# EAGLE design pump (EAGLE 9.4.2)
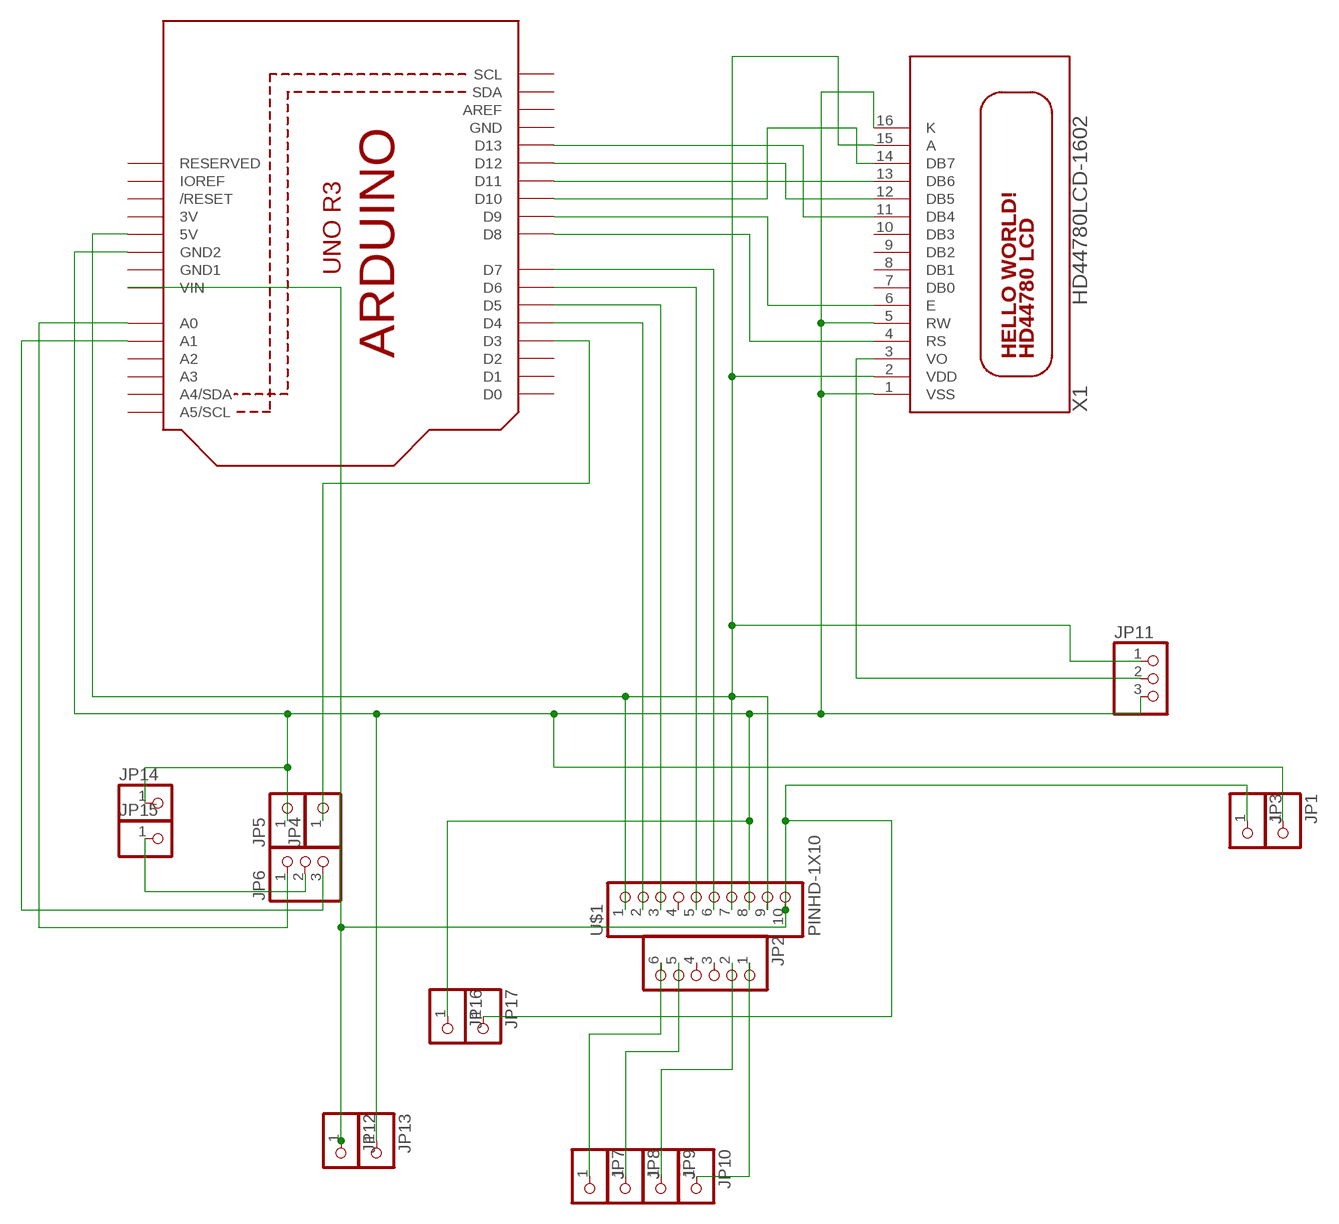
[diagram p0: schematic, sheet 1]

## Parts
JP1  PINHD-1X1CB  [1X01-CLEANBIG]
JP2  PINHD-1X6CB  [1X06-CLEANBIG]
JP3  PINHD-1X1CB  [1X01-CLEANBIG]
JP4  PINHD-1X1CB  [1X01-CLEANBIG]
JP5  PINHD-1X1CB  [1X01-CLEANBIG]
JP6  PINHD-1X3  [1X03]
JP7  PINHD-1X1  [1X01]
JP8  PINHD-1X1  [1X01]
JP9  PINHD-1X1  [1X01]
JP10  PINHD-1X1  [1X01]
JP11  PINHD-1X3  [1X03]
JP12  PINHD-1X1  [1X01]
JP13  PINHD-1X1  [1X01]
JP14  PINHD-1X1  [1X01]
JP15  PINHD-1X1  [1X01]
JP16  PINHD-1X1  [1X01]
JP17  PINHD-1X1  [1X01]
U1  ARDUINOR3-BPLACE  [ARDUINOR3-BPLACE]
U$1  PINHD-1X10  [1X10-BIG]
X1  HD44780LCD-1602  [LCD1602]

## Nets
N$1: JP6.2 JP15.1
N$3: JP6.1 U1.A0
N$4: JP6.3 U1.A1
N$5: JP3.1 JP12.1 JP17.1 U1.VIN U$1.10
N$6: JP4.1 U1.D3
N$8: JP11.2 X1.3(VO)
N$12: U1.D13 X1.11(DB4)
N$13: U1.D12 X1.12(DB5)
N$14: U1.D11 X1.13(DB6)
N$15: U1.D10 X1.14(DB7)
N$16: U1.D9 X1.6(E)
N$17: U1.D8 X1.4(RS)
N$18: U1.D7 U$1.6
N$19: U1.D6 U$1.5
N$20: U1.D5 U$1.3
N$21: U1.D4 U$1.2
N$22: JP2.6 JP7.1
N$23: JP2.5 JP8.1
N$24: JP2.2 JP9.1
N$25: JP2.1 JP10.1
VDD: JP11.1 U1.5V U$1.1 U$1.7 U$1.9 X1.2(VDD) X1.15(A)
VSS: JP1.1 JP5.1 JP11.3 JP13.1 JP14.1 JP16.1 U1.GND2 U$1.8 X1.1(VSS) X1.5(RW) X1.16(K)
Unconnected: JP2.3 JP2.4 U1.A2 U1.A3 U1.A4(A4/SDA) U1.A5(A5/SCL) U1.AREF U1.D0 U1.D1 U1.D2 U1.IOREF U1.RESERVED U1.RESET(/RESET) U1.SCL U1.SDA U$1.4 X1.7(DB0) X1.8(DB1) X1.9(DB2) X1.10(DB3)

## Power pins joined to a net without a drawn wire
3V: U1.3V
GND: U1.GND
GND1: U1.GND1

## Library data of the parts
JP1 JP3-JP5 JP7-JP10 JP12-JP17 = adafruit:PINHD-1X1: Pin header 1x1 for 0.1" spacing With round pins
JP2 = adafruit:PINHD-1X6: PIN HEADER
JP6 JP11 = adafruit:PINHD-1X3: PIN HEADER
U1 = adafruit:ARDUINOR3: This is a new object for the new Arduino R3 - with extra pins that you may want to use (such as IOref, and duplicated A4/A5
U$1 = adafruit:PINHD-1X10: Pin header 1x10 0.1" spacing With round pins
X1 = adafruit:HD44780LCD: HD44780 LCD Standard character type LCDs, available in sizes from 8x1 to 40x4!

## Board
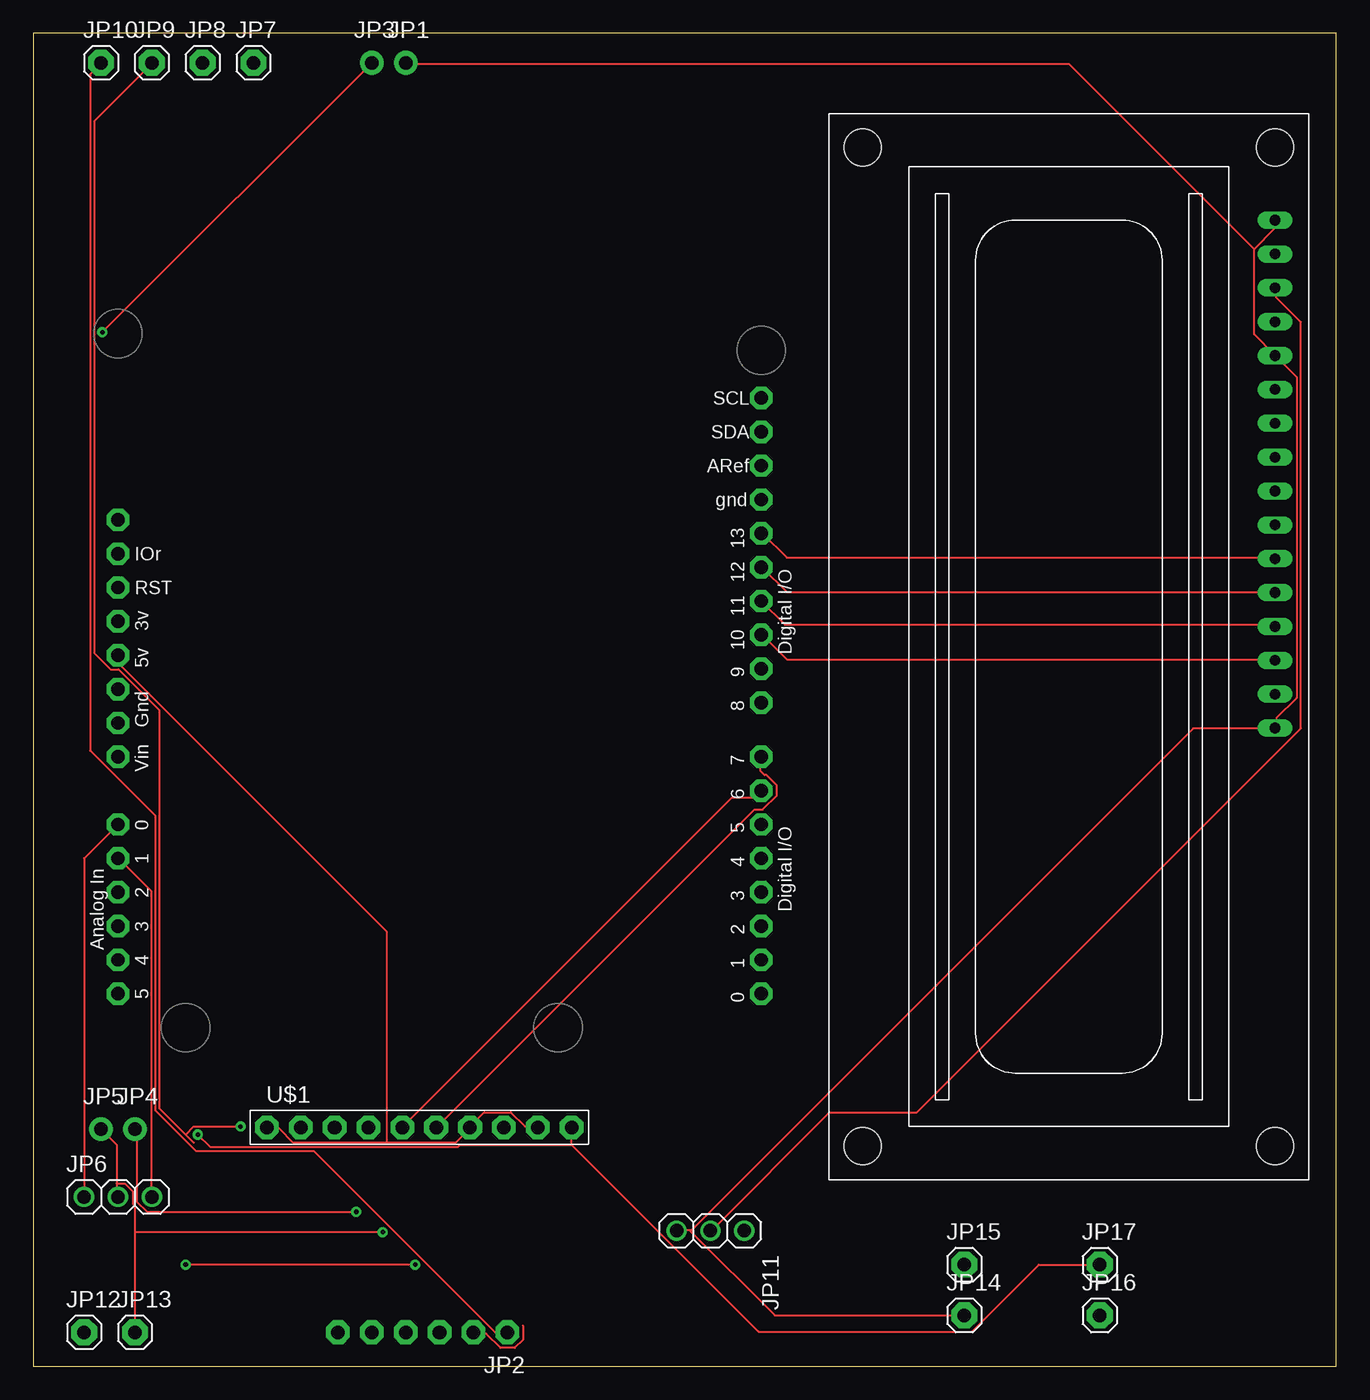
[diagram p1: board, top side]
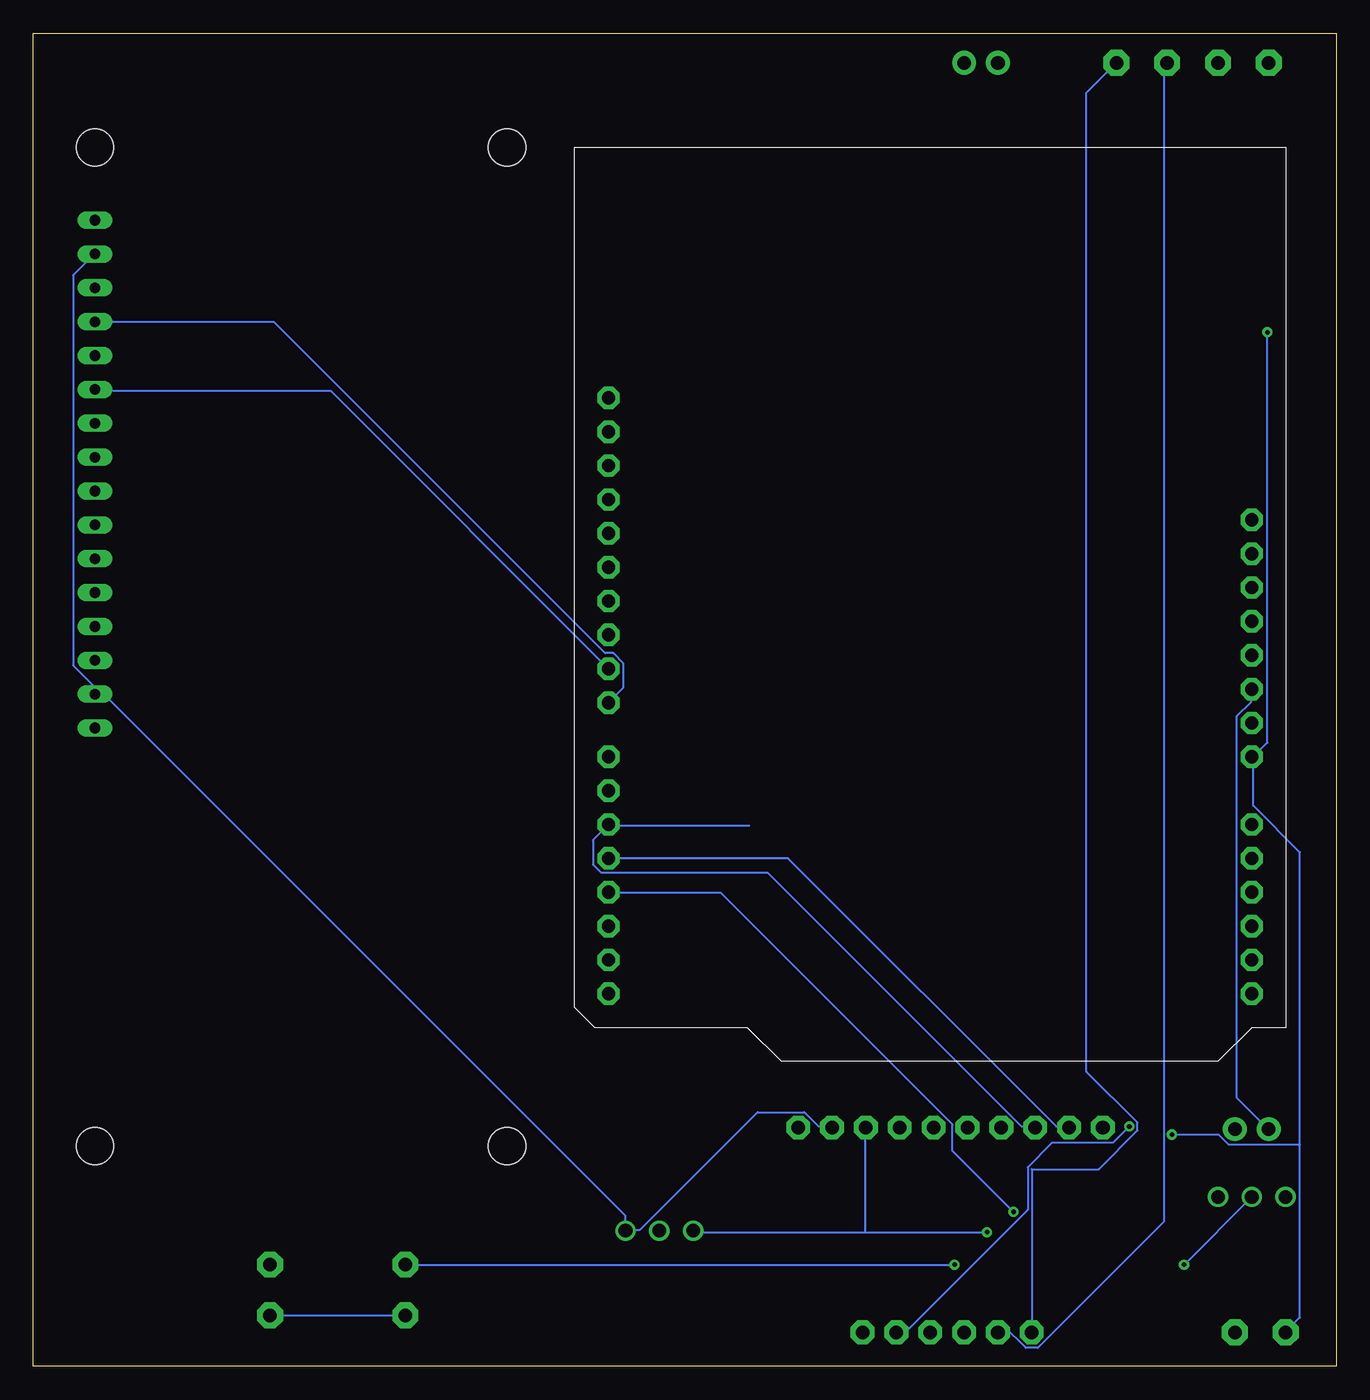
[diagram p2: board, bottom side, seen from below]

Size 97.77 x 100 mm. Coordinates in mm from the lower left corner, seen from the top.
Outline: 0,0 97.77,0 97.77,100 0,100 0,0
Copper layers (1*16): Top 0.035mm / dielectric 1.5mm / Bottom 0.035mm
Design rules "default": minimum track width 6mil, minimum drill 0.35mm, track to track 6mil, track to pad 6mil, pad to pad 6mil, via to via 6mil, smd to smd 6mil, copper to edge 40mil, drill to drill 6mil, minimum pad ring 10mil, minimum via ring 8mil, stop-mask expansion 4mil, vias tented up to drill 0mil, thermal gap 10mil

### Footprints (pad centres in the part's own frame; a part is rotated, then mirrored left to right if it is on the bottom)
1X01-CLEANBIG = drill 1.016 pad 1.778: 1 0,0
1X06-CLEANBIG = drill 1.016 pad 1.778 octagon: 1 -6.35,0; 2 -3.81,0; 3 -1.27,0; 4 1.27,0; 5 3.81,0; 6 6.35,0
1X03 = drill 1.016: 1 -2.54,0; 2 0,0; 3 2.54,0
1X01 = drill 1.016 pad 1.93 octagon: 1 0,0
ARDUINOR3-BPLACE = drill 1 pad 1.676 octagon: 3V 35.56,2.54; 5V 38.1,2.54; A0 50.8,2.54; A1 53.34,2.54; A2 55.88,2.54; A3 58.42,2.54; A4 60.96,2.54; A5 63.5,2.54; AREF 23.876,50.8; D0 63.5,50.8; D1 60.96,50.8; D2 58.42,50.8; D3 55.88,50.8; D4 53.34,50.8; D5 50.8,50.8; D6 48.26,50.8; D7 45.72,50.8; D8 41.656,50.8; D9 39.116,50.8; D10 36.576,50.8; D11 34.036,50.8; D12 31.496,50.8; D13 28.956,50.8; GND 26.416,50.8; GND1 43.18,2.54; GND2 40.64,2.54; IOREF 30.48,2.54; RESERVED 27.94,2.54; RESET 33.02,2.54; SCL 18.796,50.8; SDA 21.336,50.8; VIN 45.72,2.54
1X10-BIG = drill 1.016 pad 1.778 octagon: 1 -11.43,0; 2 -8.89,0; 3 -6.35,0; 4 -3.81,0; 5 -1.27,0; 6 1.27,0; 7 3.81,0; 8 6.35,0; 9 8.89,0; 10 11.43,0
LCD1602 = drill 0.8 long: 1 8,33.46; 2 10.54,33.46; 3 13.08,33.46; 4 15.62,33.46; 5 18.16,33.46; 6 20.7,33.46; 7 23.24,33.46; 8 25.78,33.46; 9 28.32,33.46; 10 30.86,33.46; 11 33.4,33.46; 12 35.94,33.46; 13 38.48,33.46; 14 41.02,33.46; 15 43.56,33.46; 16 46.1,33.46 | hole 2.8: 2.54,2.54; 2.54,33.46; 77.46,33.46; 77.46,2.54

### Placement (x,y rotation side)
JP1  27.94,97.79 0 top
JP2  29.21,2.54 180 top
JP3  25.4,97.79 0 top
JP4  7.62,17.78 0 top
JP5  5.08,17.78 0 top
JP6  6.35,12.7 0 top
JP7  16.51,97.79 0 top
JP8  12.7,97.79 0 top
JP9  8.89,97.79 0 top
JP10  5.08,97.79 0 top
JP11  50.8,10.16 180 top
JP12  3.81,2.54 0 top
JP13  7.62,2.54 0 top
JP14  69.85,3.81 0 top
JP15  69.85,7.62 0 top
JP16  80.01,3.81 0 top
JP17  80.01,7.62 0 top
U1  3.81,91.44 270 top
U$1  28.96,17.91 0 top
X1  59.69,93.98 270 top

### Tracks (layer width: path | path; a pad name or v marks a point on that pad's centre or on a via)
N$1  (via drill 0.35)
  Top 0.152: v28.65,7.62 v11.43,7.62
  Bottom 0.152: v11.43,7.62 JP6.2 | JP15.1 v28.65,7.62
N$3
  Top 0.152: JP6.1 3.81,38.1 U1.A0
N$4
  Top 0.152: JP6.3 8.84,12.8 8.84,35.66 6.4,38.1 U1.A1
N$5  (via drill 0.35)
  Top 0.152: v5.18,77.57 JP3.1 | JP17.1 75.44,7.62 70.41,2.59 54.41,2.59 40.39,16.61 | 40.39,16.61 U$1.10 | 40.39,16.61 32,16.61 31.85,16.46 13.26,16.46 v12.34,17.37
  Bottom 0.152: 6.25,45.72 6.25,42.06 2.74,38.56 2.74,16.61 | 2.74,16.61 2.74,3.66 3.81,2.59 JP12.1 | v12.34,17.37 8.84,17.37 8.08,16.61 2.74,16.61 | v5.18,77.57 5.18,46.79 6.25,45.72 | 6.25,45.72 U1.VIN
N$6  (via drill 0.35)
  Top 0.152: v24.23,11.58 8.53,11.58 7.77,12.34 7.77,17.53 7.62,17.68 JP4.1
  Bottom 0.152: U1.D3 54.56,35.51 46.18,35.51 28.8,18.14 28.8,16.15 v24.23,11.58
N$8
  Top 0.152: X1.3 93.27,80.77 93.27,80.16 95.1,78.33 95.1,47.85 66.29,19.05 59.74,19.05 50.9,10.21 JP11.2
N$12
  Top 0.152: X1.11 93.12,60.66 56.54,60.66 54.71,62.48 U1.D13
N$13
  Top 0.152: X1.12 93.12,58.06 56.54,58.06 54.71,59.89 U1.D12
N$14
  Top 0.152: U1.D11 56.39,55.63 93.12,55.63 X1.13
N$15
  Top 0.152: X1.14 93.12,53.03 56.54,53.03 54.71,54.86 U1.D10
N$16
  Bottom 0.152: U1.D9 75.44,73.15 93.12,73.15 X1.6
N$17
  Bottom 0.152: U1.D8 53.49,50.9 53.49,52.73 54.25,53.49 54.86,53.49 79.7,78.33 93.12,78.33 X1.4
N$18
  Top 0.152: U1.D7 54.56,45.72 54.56,44.65 54.86,44.35 55.02,44.35 55.78,43.59 55.78,42.82 54.71,41.76 54.1,41.76 30.33,17.98 U$1.6
N$19
  Top 0.152: 54.56,42.67 54.56,43.13 U1.D6 54.56,42.67 | 54.56,42.67 52.43,42.67 27.74,17.98 U$1.5
N$20
  Bottom 0.152: 44.04,40.54 54.56,40.54 U1.D5 55.78,39.47 55.78,37.64 55.17,37.03 42.67,37.03 23.62,17.98 22.71,17.98 U$1.3
N$21
  Bottom 0.152: U1.D4 41.15,38.1 21.03,17.98 20.12,17.98 U$1.2
N$22
  Bottom 0.152: JP2.6 22.86,14.78 17.83,14.78 14.94,17.68 14.94,18.29 18.75,22.1 18.75,95.56 JP7.1
N$23
  Bottom 0.152: JP8.1 12.95,97.54 12.95,10.82 22.4,1.37 23.32,1.37 24.94,3 JP2.5
N$24  (via drill 0.35)
  Top 0.152: 36.73,3.05 36.73,1.98 36.12,1.37 35.05,1.37 33.98,2.44 33.07,2.44 JP2.2 | 11.43,17.37 9.45,19.36 9.45,49.23 6.4,52.27 5.79,52.27 4.57,53.49 4.57,93.42 8.84,97.69 JP9.1 | 11.43,17.37 12.04,16.76 | v15.54,17.98 12.04,17.98 11.43,17.37
  Bottom 0.152: v15.54,17.98 16.76,16.76 21.34,16.76 23.16,14.94 23.16,11.73 32.31,2.59 32.92,2.59 JP2.2
N$25
  Top 0.152: JP2.1 34.65,2.54 21.03,16.15 12.19,16.15 9.14,19.2 9.14,41.3 4.27,46.18 4.27,96.93 5.03,97.69 JP10.1
VDD
  Top 0.152: U1.5V 6.4,53.34 6.4,52.73 26.52,32.61 26.52,16.76 | 26.52,16.76 31.7,16.76 32.77,17.83 U$1.7 32.77,17.98 33.83,19.05 35.81,19.05 36.88,17.98 37.8,17.98 U$1.9 | 26.52,16.76 19.51,16.76 18.44,17.83 17.53,17.83 U$1.1
  Bottom 0.152: X1.2 93.27,83.36 94.79,81.84 94.79,52.58 93.27,51.05 93.27,50.44 X1.15 93.12,50.29 92.35,50.29 53.34,11.28 53.34,10.21 | 53.34,10.21 52.27,10.21 43.43,19.05 39.93,19.05 38.86,17.98 37.95,17.98 U$1.9 | 53.34,10.21 JP11.1
VSS  (via drill 0.35)
  Top 0.152: 6.25,13.72 6.25,16.61 JP5.1 | 6.25,13.72 6.25,12.8 | 7.62,10.06 7.62,12.04 7.47,12.19 7.47,13.11 6.86,13.72 6.25,13.72 | 7.62,10.06 JP13.1 | 91.59,83.82 93.12,85.34 93.12,85.95 X1.1 | 91.59,83.82 91.59,77.42 93.12,75.89 X1.5 93.27,75.74 94.79,74.22 94.79,50.14 93.27,48.62 93.27,48.01 X1.16 93.12,47.85 87.02,47.85 49.38,10.21 49.23,10.21 | 49.23,10.21 48.31,10.21 JP11.3 | 91.59,83.82 77.72,97.69 28.04,97.69 JP1.1 | v26.21,10.06 7.62,10.06 | JP14.1 55.63,3.81 49.23,10.21
  Bottom 0.152: U1.GND2 6.4,50.75 6.4,49.84 7.47,48.77 7.47,20.12 5.18,17.83 JP5.1 | 35.36,10.06 48.16,10.06 JP11.3 | 35.36,10.06 v26.21,10.06 | JP16.1 JP14.1 | 35.36,10.06 35.36,17.83 U$1.8

### Text on the board
Document: STEPPER | FAN+ | FAN- | LCD | ARDUINO UNO | ENCODER | - | TB6612 | STEPPER DRIVER | POT+ | POT- | 12V | GND | ENC BYPASS | 47uF CAP